# Altium schematic sheet CATS-Vega-Telemetry.SchDoc: CATS Vega
size A4; Author: Luca Jost; Revision: V1.0; SheetNumber: 11; SheetTotal: 16; Subtitle: Telemetry
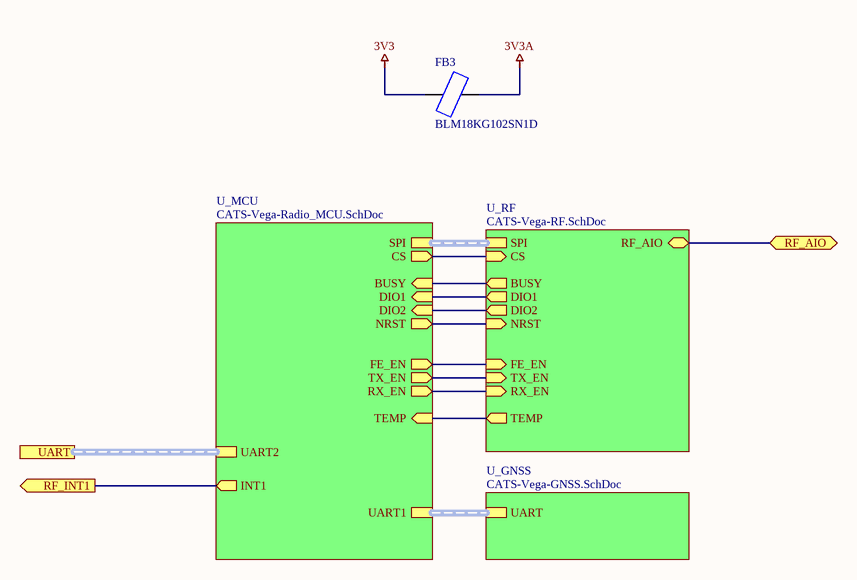
[diagram p0: CATS-Vega-Telemetry.SchDoc]

## Parts
FB3  BLM18KG102SN1D  [SMD Ferrite Bead 0603]

## Sub-sheets
U_GNSS = CATS-Vega-GNSS.SchDoc: UART (harness UART)
U_MCU = CATS-Vega-Radio_MCU.SchDoc: SPI (harness SPI), CS (out), FE_EN (out), TX_EN (out), BUSY (in), DIO1 (in), DIO2 (in), TEMP (in), UART1 (harness UART), UART2 (harness UART), RX_EN (out), INT1 (out), NRST (out)
U_RF = CATS-Vega-RF.SchDoc: SPI (harness SPI), CS (in), BUSY (out), DIO1 (out), DIO2 (out), TEMP (out), FE_EN (in), TX_EN (in), RX_EN (in), RF_AIO (bidir), NRST (in)

## Ports
RF_AIO (bidir), RF_INT1 (out), UART

## Nets
3V3: FB3.2
3V3A: FB3.1
RF_AIO: port RF_AIO, sheet U_RF/RF_AIO
RF_INT1: port RF_INT1, sheet U_MCU/INT1
(unnamed): sheet U_MCU/CS, sheet U_RF/CS
(unnamed): sheet U_MCU/FE_EN, sheet U_RF/FE_EN
(unnamed): sheet U_MCU/TX_EN, sheet U_RF/TX_EN
(unnamed): sheet U_MCU/BUSY, sheet U_RF/BUSY
(unnamed): sheet U_MCU/DIO1, sheet U_RF/DIO1
(unnamed): sheet U_MCU/DIO2, sheet U_RF/DIO2
(unnamed): sheet U_MCU/TEMP, sheet U_RF/TEMP
(unnamed): sheet U_MCU/RX_EN, sheet U_RF/RX_EN
(unnamed): sheet U_MCU/NRST, sheet U_RF/NRST

## Buses and harness runs
harness port UART = sheet U_MCU/UART2
harness sheet U_GNSS/UART = sheet U_MCU/UART1
harness sheet U_MCU/SPI = sheet U_RF/SPI

## Notes on the sheet
- Title
- Author:
- Subtitle
- Date:
- Rev:
- File:
- Sheet
- of

## Library data of the parts
FB3 = BLM18KG102SN1D: 1 kOhms @ 100MHz 1 Power Line Ferrite Bead 0603 (1608 Metric) 1A 200mOhm; ComponentLink1Description: Datasheet; ComponentLink1URL: https://www.murata.com/en-us/products/productdata/8796738650142/ENFA0003.pdf; Digikey: 490-17349-1-ND; JLC: C42102; Unit Price: 0.0058